# EAGLE design Pi_Cap (EAGLE 6.5.0)
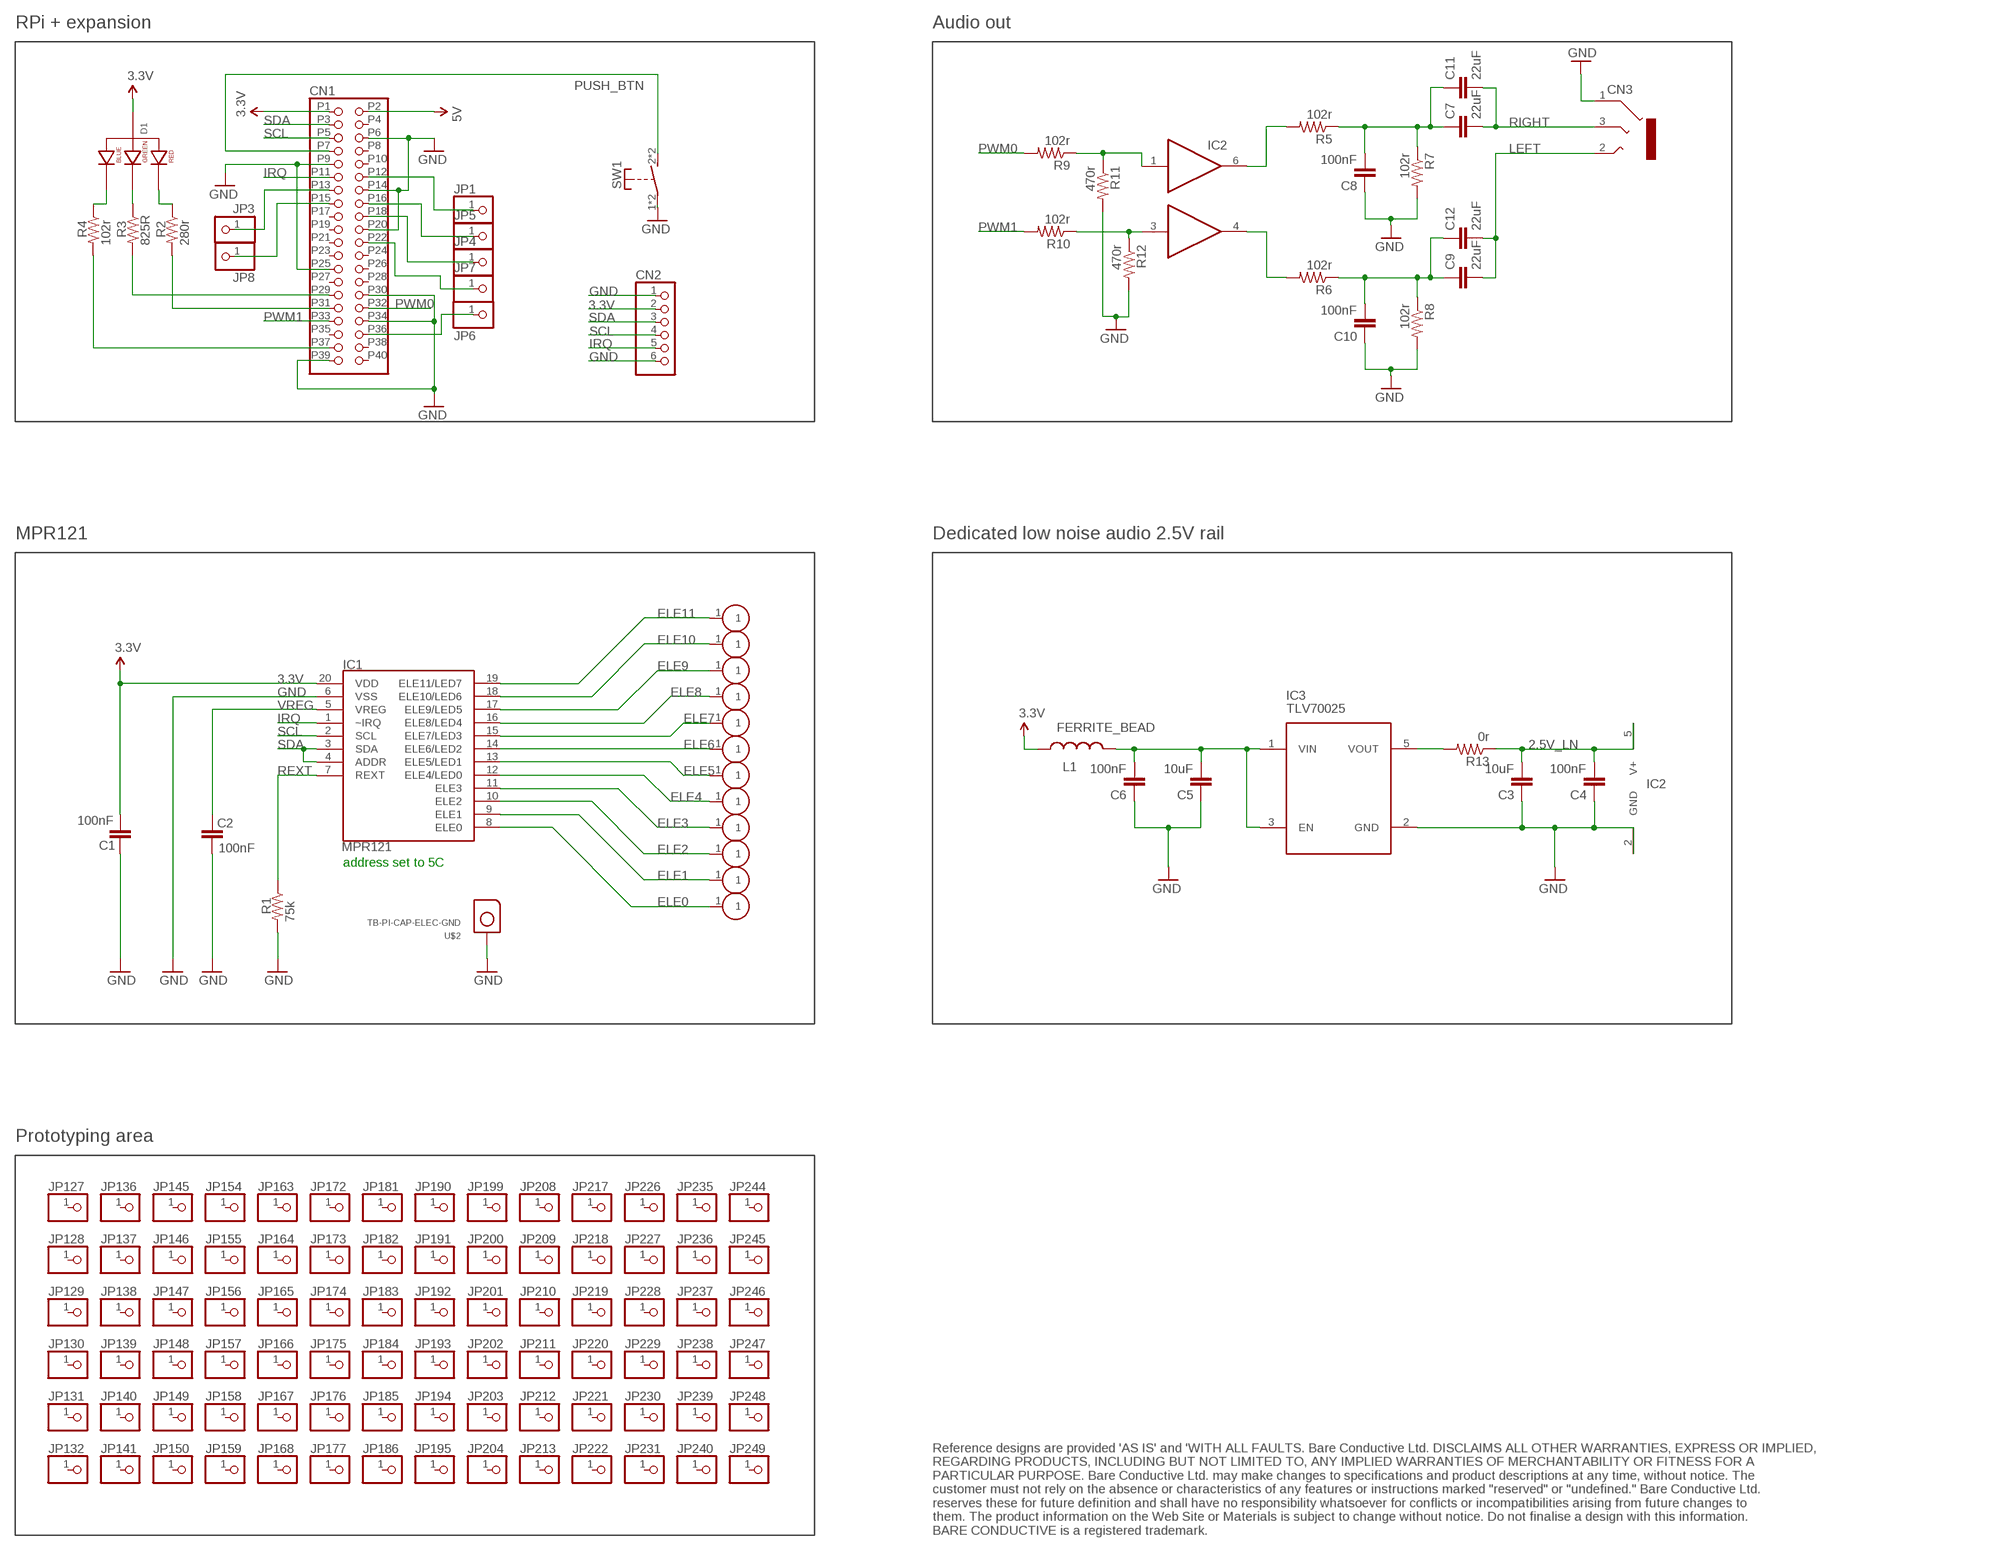
[diagram p0: schematic, sheet 1]

## Parts
C1  100nF  CAP0402-CAP  [0402-CAP]
C2  100nF  CAP0402-CAP  [0402-CAP]
C3  10uF  CAP1206  [1206]
C4  100nF  CAP0402-CAP  [0402-CAP]
C5  10uF  CAP1206  [1206]
C6  100nF  CAP0402-CAP  [0402-CAP]
C7  22uF  CAP1206  [1206]
C8  100nF  CAP0402-CAP  [0402-CAP]
C9  22uF  CAP1206  [1206]
C10  100nF  CAP0402-CAP  [0402-CAP]
C11  22uF  CAP1206  [1206]
C12  22uF  CAP1206  [1206]
CN1  PINHD-2X20/2X20_SMD  [2X20_SMD]
CN2  6W_0.5MM_FFC_RA_SMD  6W_0.5MM_FFC_RA  [6W_0.5MM_FFC_RA_SMD]
CN3  STEREO_SOCKET  SMD_STEREO_SOCKET  [SMD_STEREO_SOCKET]
D1  PLCC4_RGB_LED  LED_RGB_CA  [LED-3528]
IC1  MPR121  MPR121QFN20  [QFN-20-0.4MM]
IC2  DUAL_BUFFER  74LVC2G34GW  [SOT-363]
IC3  TLV70025  TLV00XX  [SC70]
JP1  PINHD-1X1CB  [1X01-CLEANBIG]
JP3  PINHD-1X1CB  [1X01-CLEANBIG]
JP4  PINHD-1X1CB  [1X01-CLEANBIG]
JP5  PINHD-1X1CB  [1X01-CLEANBIG]
JP6  PINHD-1X1CB  [1X01-CLEANBIG]
JP7  PINHD-1X1CB  [1X01-CLEANBIG]
JP8  PINHD-1X1CB  [1X01-CLEANBIG]
JP127  PINHD-1X1CB  [1X01-CLEANBIG]
JP128  PINHD-1X1CB  [1X01-CLEANBIG]
JP129  PINHD-1X1CB  [1X01-CLEANBIG]
JP130  PINHD-1X1CB  [1X01-CLEANBIG]
JP131  PINHD-1X1CB  [1X01-CLEANBIG]
JP132  PINHD-1X1CB  [1X01-CLEANBIG]
JP136  PINHD-1X1CB  [1X01-CLEANBIG]
JP137  PINHD-1X1CB  [1X01-CLEANBIG]
JP138  PINHD-1X1CB  [1X01-CLEANBIG]
JP139  PINHD-1X1CB  [1X01-CLEANBIG]
JP140  PINHD-1X1CB  [1X01-CLEANBIG]
JP141  PINHD-1X1CB  [1X01-CLEANBIG]
JP145  PINHD-1X1CB  [1X01-CLEANBIG]
JP146  PINHD-1X1CB  [1X01-CLEANBIG]
JP147  PINHD-1X1CB  [1X01-CLEANBIG]
JP148  PINHD-1X1CB  [1X01-CLEANBIG]
JP149  PINHD-1X1CB  [1X01-CLEANBIG]
JP150  PINHD-1X1CB  [1X01-CLEANBIG]
JP154  PINHD-1X1CB  [1X01-CLEANBIG]
JP155  PINHD-1X1CB  [1X01-CLEANBIG]
JP156  PINHD-1X1CB  [1X01-CLEANBIG]
JP157  PINHD-1X1CB  [1X01-CLEANBIG]
JP158  PINHD-1X1CB  [1X01-CLEANBIG]
JP159  PINHD-1X1CB  [1X01-CLEANBIG]
JP163  PINHD-1X1CB  [1X01-CLEANBIG]
JP164  PINHD-1X1CB  [1X01-CLEANBIG]
JP165  PINHD-1X1CB  [1X01-CLEANBIG]
JP166  PINHD-1X1CB  [1X01-CLEANBIG]
JP167  PINHD-1X1CB  [1X01-CLEANBIG]
JP168  PINHD-1X1CB  [1X01-CLEANBIG]
JP172  PINHD-1X1CB  [1X01-CLEANBIG]
JP173  PINHD-1X1CB  [1X01-CLEANBIG]
JP174  PINHD-1X1CB  [1X01-CLEANBIG]
JP175  PINHD-1X1CB  [1X01-CLEANBIG]
JP176  PINHD-1X1CB  [1X01-CLEANBIG]
JP177  PINHD-1X1CB  [1X01-CLEANBIG]
JP181  PINHD-1X1CB  [1X01-CLEANBIG]
JP182  PINHD-1X1CB  [1X01-CLEANBIG]
JP183  PINHD-1X1CB  [1X01-CLEANBIG]
JP184  PINHD-1X1CB  [1X01-CLEANBIG]
JP185  PINHD-1X1CB  [1X01-CLEANBIG]
JP186  PINHD-1X1CB  [1X01-CLEANBIG]
JP190  PINHD-1X1CB  [1X01-CLEANBIG]
JP191  PINHD-1X1CB  [1X01-CLEANBIG]
JP192  PINHD-1X1CB  [1X01-CLEANBIG]
JP193  PINHD-1X1CB  [1X01-CLEANBIG]
JP194  PINHD-1X1CB  [1X01-CLEANBIG]
JP195  PINHD-1X1CB  [1X01-CLEANBIG]
JP199  PINHD-1X1CB  [1X01-CLEANBIG]
JP200  PINHD-1X1CB  [1X01-CLEANBIG]
JP201  PINHD-1X1CB  [1X01-CLEANBIG]
JP202  PINHD-1X1CB  [1X01-CLEANBIG]
JP203  PINHD-1X1CB  [1X01-CLEANBIG]
JP204  PINHD-1X1CB  [1X01-CLEANBIG]
JP208  PINHD-1X1CB  [1X01-CLEANBIG]
JP209  PINHD-1X1CB  [1X01-CLEANBIG]
JP210  PINHD-1X1CB  [1X01-CLEANBIG]
JP211  PINHD-1X1CB  [1X01-CLEANBIG]
JP212  PINHD-1X1CB  [1X01-CLEANBIG]
JP213  PINHD-1X1CB  [1X01-CLEANBIG]
JP217  PINHD-1X1CB  [1X01-CLEANBIG]
JP218  PINHD-1X1CB  [1X01-CLEANBIG]
JP219  PINHD-1X1CB  [1X01-CLEANBIG]
JP220  PINHD-1X1CB  [1X01-CLEANBIG]
JP221  PINHD-1X1CB  [1X01-CLEANBIG]
JP222  PINHD-1X1CB  [1X01-CLEANBIG]
JP226  PINHD-1X1CB  [1X01-CLEANBIG]
JP227  PINHD-1X1CB  [1X01-CLEANBIG]
JP228  PINHD-1X1CB  [1X01-CLEANBIG]
JP229  PINHD-1X1CB  [1X01-CLEANBIG]
JP230  PINHD-1X1CB  [1X01-CLEANBIG]
JP231  PINHD-1X1CB  [1X01-CLEANBIG]
JP235  PINHD-1X1CB  [1X01-CLEANBIG]
JP236  PINHD-1X1CB  [1X01-CLEANBIG]
JP237  PINHD-1X1CB  [1X01-CLEANBIG]
JP238  PINHD-1X1CB  [1X01-CLEANBIG]
JP239  PINHD-1X1CB  [1X01-CLEANBIG]
JP240  PINHD-1X1CB  [1X01-CLEANBIG]
JP244  PINHD-1X1CB  [1X01-CLEANBIG]
JP245  PINHD-1X1CB  [1X01-CLEANBIG]
JP246  PINHD-1X1CB  [1X01-CLEANBIG]
JP247  PINHD-1X1CB  [1X01-CLEANBIG]
JP248  PINHD-1X1CB  [1X01-CLEANBIG]
JP249  PINHD-1X1CB  [1X01-CLEANBIG]
L1  FERRITE_BEAD  INDUCTOR0402  [C0402]
R1  75k  RESISTOR0402-RES  [0402-RES]
R2  280r  RESISTOR0402-RES  [0402-RES]
R3  825R  RESISTOR0402-RES  [0402-RES]
R4  102r  RESISTOR0402-RES  [0402-RES]
R5  102r  RESISTOR0402-RES  [0402-RES]
R6  102r  RESISTOR0402-RES  [0402-RES]
R7  102r  RESISTOR0402-RES  [0402-RES]
R8  102r  RESISTOR0402-RES  [0402-RES]
R9  102r  RESISTOR0402-RES  [0402-RES]
R10  102r  RESISTOR0402-RES  [0402-RES]
R11  470r  RESISTOR0402-RES  [0402-RES]
R12  470r  RESISTOR0402-RES  [0402-RES]
R13  0r  RESISTOR0402-RES  [0402-RES]
SW1  SMD_RA_PUSH_SW  [SMD_RA_PUSH_SW]
U$1  EDGE-ELEC-LEFT  [EDGE-ELEC-LEFT]
U$2  TB-PI-CAP-ELEC-GND  [TB-PI-CAP-ELEC-GND]
U$3  EDGE-ELEC-RIGHT  [EDGE-ELEC-RIGHT]
U$17  EDGE-ELEC  [EDGE-ELEC]
U$18  EDGE-ELEC  [EDGE-ELEC]
U$22  EDGE-ELEC  [EDGE-ELEC]
U$24  EDGE-ELEC  [EDGE-ELEC]
U$26  EDGE-ELEC  [EDGE-ELEC]
U$27  EDGE-ELEC  [EDGE-ELEC]
U$28  EDGE-ELEC  [EDGE-ELEC]
U$29  EDGE-ELEC  [EDGE-ELEC]
U$30  EDGE-ELEC  [EDGE-ELEC]
U$31  EDGE-ELEC  [EDGE-ELEC]

## Nets
2.5V_LN: C3.2 C4.2 IC2.5(V+) R13.1
3.3V: C1.1 CN1.P1 CN2.2 D1.1(ANODE) IC1.20(VDD) L1.1
5V: CN1.P2
ELE0: IC1.8(ELE0) U$1.1
ELE1: IC1.9(ELE1) U$31.1
ELE2: IC1.10(ELE2) U$30.1
ELE3: IC1.11(ELE3) U$29.1
ELE4: IC1.12(ELE4/LED0) U$28.1
ELE5: IC1.13(ELE5/LED1) U$27.1
ELE6: IC1.14(ELE6/LED2) U$26.1
ELE7: IC1.15(ELE7/LED3) U$24.1
ELE8: IC1.16(ELE8/LED4) U$22.1
ELE9: IC1.17(ELE9/LED5) U$18.1
ELE10: IC1.18(ELE10/LED6) U$17.1
ELE11: IC1.19(ELE11/LED7) U$3.1
GND: C1.2 C2.1 C3.1 C4.1 C5.1 C6.1 C8.1 C10.1 CN1.P6 CN1.P9 CN1.P14 CN1.P20 CN1.P25 CN1.P30 CN1.P34 CN1.P39 CN2.1 CN2.6 CN3.1 IC1.6(VSS) IC2.2(GND) IC3.2(GND) R1.2 R7.2 R8.2 R11.2 R12.2 SW1.1(P) SW1.3(P) U$2.1
IRQ: CN1.P11 CN2.5 IC1.1(~IRQ)
LEFT: C9.2 C12.2 CN3.2
N$1: D1.2(BLUE_CATHODE) R4.1
N$2: D1.4(GREEN_CATHODE) R3.1
N$3: D1.3(RED_CATHODE) R2.1
N$4: CN1.P31 R2.2
N$5: CN1.P29 R3.2
N$6: CN1.P13 JP3.1
N$8: CN1.P37 R4.2
N$9: CN1.P36 JP6.1
N$10: CN1.P22 JP7.1
N$11: CN1.P18 JP4.1
N$12: CN1.P16 JP5.1
N$13: IC2.1(IN_1) R9.1 R11.1
N$14: CN1.P12 JP1.1
N$15: IC2.6(OUT_1) R5.2
N$16: IC2.4(OUT_2) R6.2
N$17: CN1.P15 JP8.1
N$18: C7.1 C8.2 C11.1 R5.1 R7.1
N$19: IC2.3(IN_2) R10.1 R12.1
N$20: C9.1 C10.2 C12.1 R6.1 R8.1
N$21: C5.2 C6.2 IC3.1(VIN) IC3.3(EN) L1.2
N$22: IC3.5(VOUT) R13.2
PUSH_BTN: CN1.P7 SW1.2(S) SW1.4(S)
PWM0: CN1.P32 R9.2
PWM1: CN1.P33 R10.2
REXT: IC1.7(REXT) R1.1
RIGHT: C7.2 C11.2 CN3.3
SCL: CN1.P5 CN2.4 IC1.2(SCL)
SDA: CN1.P3 CN2.3 IC1.3(SDA) IC1.4(ADDR)
VREG: C2.2 IC1.5(VREG)
Unconnected: CN1.P4 CN1.P8 CN1.P10 CN1.P17 CN1.P19 CN1.P21 CN1.P23 CN1.P24 CN1.P26 CN1.P27 CN1.P28 CN1.P35 CN1.P38 CN1.P40 JP127.1 JP128.1 JP129.1 JP130.1 JP131.1 JP132.1 JP136.1 JP137.1 JP138.1 JP139.1 JP140.1 JP141.1 JP145.1 JP146.1 JP147.1 JP148.1 JP149.1 JP150.1 JP154.1 JP155.1 JP156.1 JP157.1 JP158.1 JP159.1 JP163.1 JP164.1 JP165.1 JP166.1 JP167.1 JP168.1 JP172.1 JP173.1 JP174.1 JP175.1 JP176.1 JP177.1 JP181.1 JP182.1 JP183.1 JP184.1 JP185.1 JP186.1 JP190.1 JP191.1 JP192.1 JP193.1 JP194.1 JP195.1 JP199.1 JP200.1 JP201.1 JP202.1 JP203.1 JP204.1 JP208.1 JP209.1 JP210.1 JP211.1 JP212.1 JP213.1 JP217.1 JP218.1 JP219.1 JP220.1 JP221.1 JP222.1 JP226.1 JP227.1 JP228.1 JP229.1 JP230.1 JP231.1 JP235.1 JP236.1 JP237.1 JP238.1 JP239.1 JP240.1 JP244.1 JP245.1 JP246.1 JP247.1 JP248.1 JP249.1

## Notes on the sheet
- RPi + expansion | Audio out
- MPR121 | Dedicated low noise audio 2.5V rail
- IC2
- address set to 5C
- Prototyping area
- Reference designs are provided 'AS IS' and 'WITH ALL FAULTS. Bare Conductive Ltd. DISCLAIMS ALL OTHER WARRANTIES, EXPRESS OR IMPLIED,
  REGARDING PRODUCTS, INCLUDING BUT NOT LIMITED TO, ANY IMPLIED WARRANTIES OF MERCHANTABILITY OR FITNESS FOR A 
  PARTICULAR PURPOSE. Bare Conductive Ltd. may make changes to specifications and product descriptions at any time, without notice. The 
  customer must not rely on the absence or characteristics of any features or instructions marked "reserved" or "undefined." Bare Conductive Ltd.
  reserves these for future definition and shall have no responsibility whatsoever for conflicts or incompatibilities arising from future changes to 
  them. The product information on the Web Site or Materials is subject to change without notice. Do not finalise a design with this information.
  BARE CONDUCTIVE is a registered trademark.

## Library data of the parts
C1 C2 C4 C6 = SparkFun:CAP: Capacitor Standard 0603 ceramic capacitor, and 0.1" leaded capacitor.
C3 C5 C7-C12 = SparkFun-Passives:CAP: Capacitor Standard 0603 ceramic capacitor, and 0.1" leaded capacitor.
CN1 = BC-Connectors:PINHD-2X20: PIN HEADER
CN2 = BC-Connectors:6W_0.5MM_FFC_RA
CN3 = BC-Connectors:SMD_STEREO_SOCKET
D1 = BC-LED:LED_RGB_CA
IC1 = SparkFun:MPR121: MPR121 Capacitive Touch Sensor Controller
IC2 = BC-DigitalIC:74LVC2G34G
IC3 = BC-AnalogIC:TLV00XX
JP1 JP3-JP8 JP127-JP132 JP136-JP141 JP145-JP150 JP154-JP159 JP163-JP168 JP172-JP177 JP181-JP186 JP190-JP195 JP199-JP204 JP208-JP213 JP217-JP222 JP226-JP231 JP235-JP240 JP244-JP249 = adafruit:PINHD-1X1: Pin header 1x1 for 0.1" spacing With round pins
L1 = SparkFun-Passives:INDUCTOR: Inductors Basic Inductor/Choke - 0603 and 1206. Footprints are not proven and vary greatly between part numbers. SRN6045- 33uH, 20% 1.4A SDR0403-560KL - 56uH, 10%, 500mA RMS/740mA peak
R1-R4 = SparkFun:RESISTOR: Resistor Basic schematic elements and footprints for 0603, 1206, and PTH resistors.
R5-R13 = SparkFun-Passives:RESISTOR: Resistor Basic schematic elements and footprints for 0603, 1206, and PTH resistors.
SW1 = BC-Electromechanical:SMD_RA_PUSH_SW
U$1 = BareConductiveLbr:EDGE-ELEC-LEFT
U$2 = BC-Connectors:TB-PI-CAP-ELEC-GND
U$3 = BareConductiveLbr:EDGE-ELEC-RIGHT
U$17 U$18 U$22 U$24 U$26-U$31 = BareConductiveLbr:EDGE-ELEC

## Net classes
1 power: width 0.254 mm, drill 0.61 mm, clearance 0.254 mm
2 gnd: width 0.254 mm, drill 0.61 mm, clearance 0.254 mm
3 usbvcc: width 0.254 mm, drill 0.61 mm, clearance 0.254 mm
4 aref: width 0.254 mm, drill 0.61 mm, clearance 0.254 mm

## Board
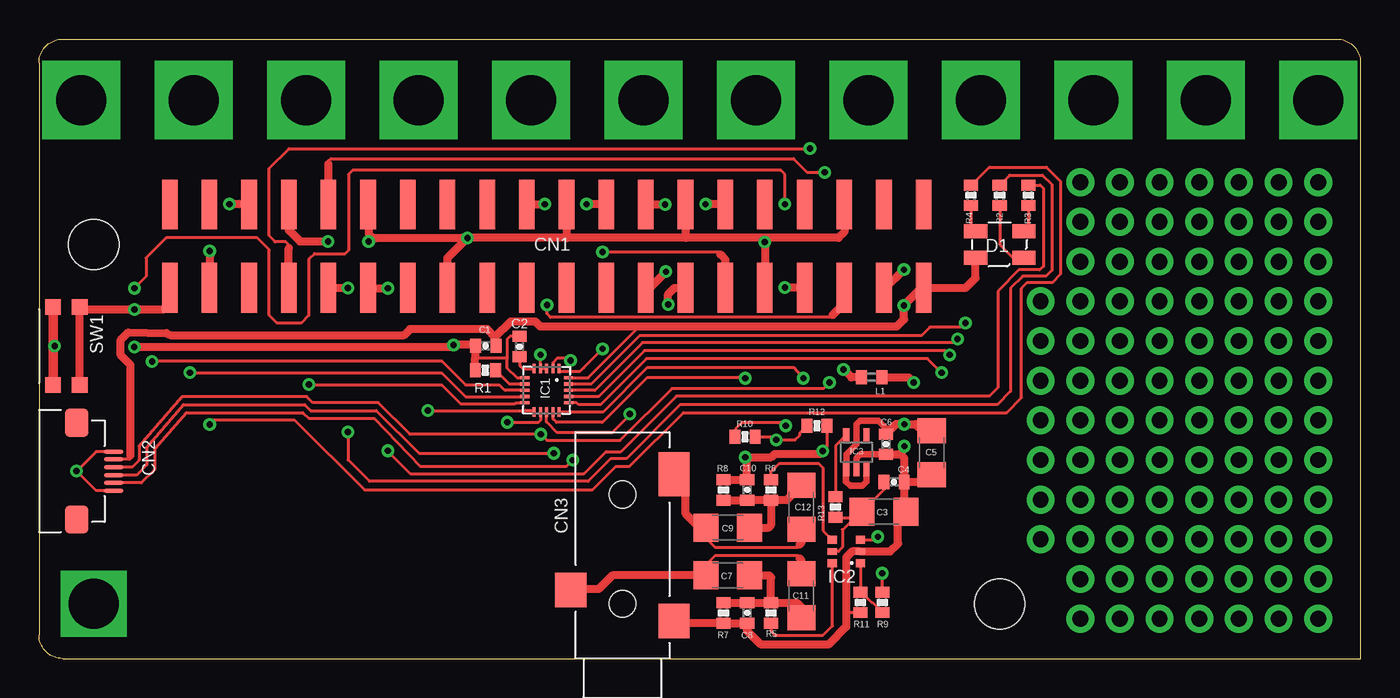
[diagram p1: board, top side]
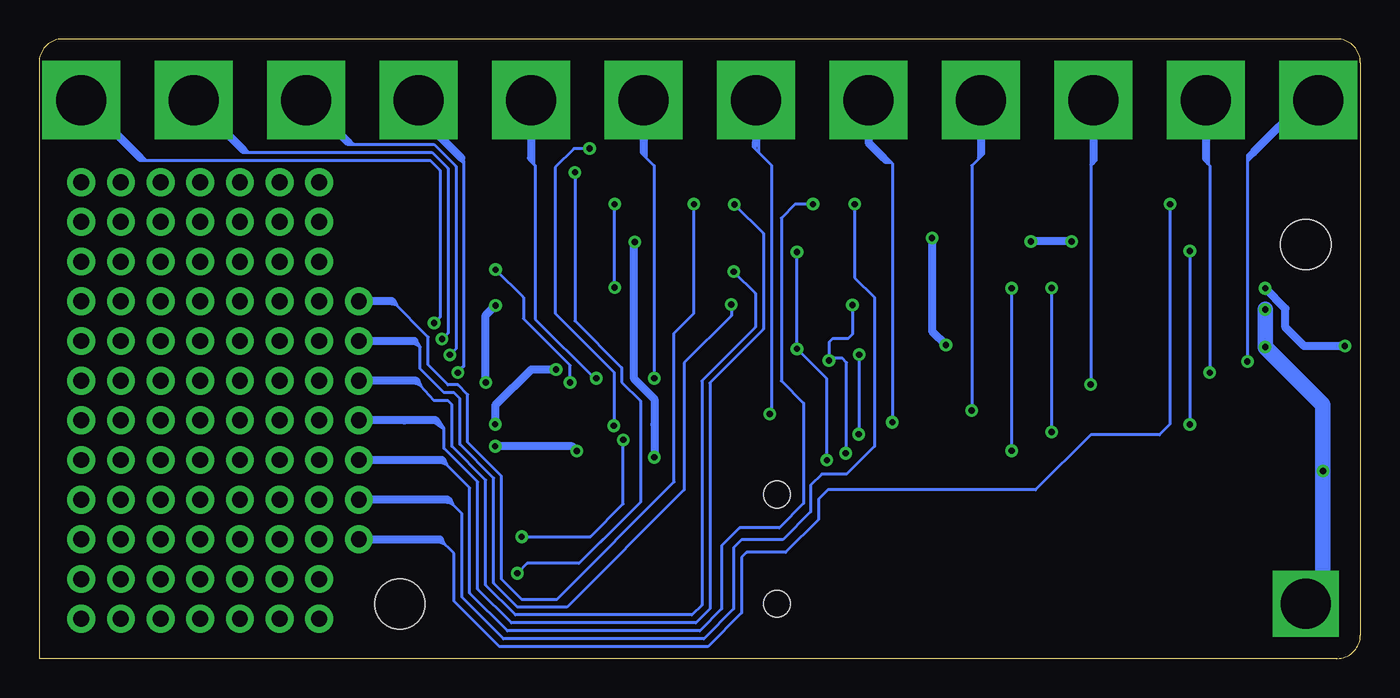
[diagram p2: board, bottom side, seen from below]

Size 84.6 x 39.65 mm. Coordinates in mm from the lower left corner, seen from the top.
Outline: 0,1.5 0,38.15 arc-90 1.5,39.65 83.1,39.65 arc-90 84.6,38.15 84.6,0 1.5,0
Outline: 1.5,0 arc-90 0,1.5
Copper layers (1*2+15*16): Top 0.035mm / dielectric 1.5mm / Route2 0.035mm / dielectric 0.15mm / Route15 0.035mm / dielectric 0.2mm / Bottom 0.035mm
Design rules "default *": minimum track width 6mil, minimum drill 0.4mm, track to track 6mil, track to pad 6mil, pad to pad 6mil, via to via 6mil, smd to smd 6mil, copper to edge 20mil, drill to drill 8mil, minimum pad ring 10mil, minimum via ring 8mil, stop-mask expansion 4mil, vias tented up to drill 0.4mm, thermal gap 10mil
Holes 3.2 mm at 3.5,26.5 61.5,3.5
tKeepout: area 0.5,23.5 to 6.5,29.5; area 0.5,0.5 to 6.5,6.5; area 58.5,0.5 to 64.5,6.5

### Footprints (pad centres in the part's own frame; a part is rotated, then mirrored left to right if it is on the bottom)
0402-CAP = smd 0.7 x 0.9: 1 -0.65,0; 2 0.65,0
1206 = smd 1.6 x 1.8: 1 -1.4,0; 2 1.4,0
2X20_SMD = smd 1 x 3.17: P1 24.13,-2.665; P2 24.13,2.665; P3 21.59,-2.665; P4 21.59,2.665; P5 19.05,-2.665; P6 19.05,2.665; P7 16.51,-2.665; P8 16.51,2.665; P9 13.97,-2.665; P10 13.97,2.665; P11 11.43,-2.665; P12 11.43,2.665; P13 8.89,-2.665; P14 8.89,2.665; P15 6.35,-2.665; P16 6.35,2.665; P17 3.81,-2.665; P18 3.81,2.665; P19 1.27,-2.665; P20 1.27,2.665; P21 -1.27,-2.665; P22 -1.27,2.665; P23 -3.81,-2.665; P24 -3.81,2.665; P25 -6.35,-2.665; P26 -6.35,2.665; P27 -8.89,-2.665; P28 -8.89,2.665; P29 -11.43,-2.665; P30 -11.43,2.665; P31 -13.97,-2.665; P32 -13.97,2.665; P33 -16.51,-2.665; P34 -16.51,2.665; P35 -19.05,-2.665; P36 -19.05,2.665; P37 -21.59,-2.665; P38 -21.59,2.665; P39 -24.13,-2.665; P40 -24.13,2.665
6W_0.5MM_FFC_RA_SMD = smd 0.3 x 1.25: 1 -1.25,4.775; 2 -0.75,4.775; 3 -0.25,4.775; 4 0.25,4.775; 5 0.75,4.775; 6 1.25,4.775 | smd 1.8 x 1.5: M1 -3.1,2.4; M2 3.1,2.4
SMD_STEREO_SOCKET = smd 2.2 x 2: 1 2.4,-3.3; 3 4.4,3.3 | smd 2.8 x 2: 2 11.8,-3.3 | hole 1.7: 3.5,0; 10.5,0
LED-3528 = smd 1.5 x 0.9: 1 1.55,0.85; 2 1.55,-0.85; 3 -1.55,0.85; 4 -1.55,-0.85
QFN-20-0.4MM = smd 0.6 x 0.2: 1 -1.4,0.8; 2 -1.4,0.4; 3 -1.4,0; 4 -1.4,-0.4; 5 -1.4,-0.8; 11 1.4,-0.8; 12 1.4,-0.4; 13 1.4,0; 14 1.4,0.4; 15 1.4,0.8 | smd 0.2 x 0.6: 6 -0.8,-1.4; 7 -0.4,-1.4; 8 0,-1.4; 9 0.4,-1.4; 10 0.8,-1.4; 16 0.8,1.4; 17 0.4,1.4; 18 0,1.4; 19 -0.4,1.4; 20 -0.8,1.4
SOT-363 = smd 0.6 x 0.5: 1 -0.9,0.75; 3 -0.9,-0.75; 4 0.9,-0.75; 6 0.9,0.75 | smd 0.6 x 0.4: 2 -0.9,0; 5 0.9,0
SC70 = smd 0.4 x 0.9: 1 -0.65,-1.1; 2 0,-1.1; 3 0.65,-1.1; 4 0.65,1.1; 5 -0.65,1.1
1X01-CLEANBIG = drill 1.016 pad 1.778: 1 0,0
C0402 = smd 0.7 x 0.9: 1 -0.65,0; 2 0.65,0
0402-RES = smd 0.7 x 0.9: 1 -0.65,0; 2 0.65,0
SMD_RA_PUSH_SW = smd 1 x 1: 1 2.5,0.85; 2 2.5,-0.85; 3 -2.5,0.85; 4 -2.5,-0.85
EDGE-ELEC-LEFT = drill 3.2 pad 5 square: 1 0,0
TB-PI-CAP-ELEC-GND = drill 3.2 pad 3.4 square: 1 0,0
EDGE-ELEC-RIGHT = drill 3.2 pad 5 square: 1 0,0
EDGE-ELEC = drill 3.2 pad 5 square: 1 0,0

### Placement (x,y rotation side)
C1  28.6,20.04 180 top
C2  30.77,19.97 270 top
C3  54.09,9.4 180 top
C4  54.74,11.3 180 top
C5  57.15,13.17 90 top
C6  54.23,13.72 90 top
C7  44.09,5.33 180 top
C8  45.34,2.92 90 top
C9  44.09,8.38 180 top
C10  45.34,10.79 270 top
C11  48.8,4.03 90 top
C12  48.8,9.69 270 top
CN1  32.5,26.4 0 top
CN2  0,12 270 top
CN3  37.35,0 90 top
D1  61.5,26.5 180 top
IC1  32.5,17.17 270 top
IC2  51.69,6.86 180 top
IC3  52.32,13.21 0 top
JP1  64.12,22.87 0 top
JP3  64.12,20.33 0 top
JP4  64.12,12.71 0 top
JP5  64.12,15.25 0 top
JP6  64.12,7.63 0 top
JP7  64.12,10.17 0 top
JP8  64.12,17.79 0 top
JP127  66.66,30.49 0 top
JP128  69.2,30.49 0 top
JP129  71.74,30.49 0 top
JP130  74.28,30.49 0 top
JP131  76.82,30.49 0 top
JP132  79.36,30.49 0 top
JP136  71.74,27.95 0 top
JP137  74.28,27.95 0 top
JP138  76.82,27.95 0 top
JP139  79.36,27.95 0 top
JP140  81.9,27.95 0 top
JP141  66.66,25.41 0 top
JP145  81.9,25.41 0 top
JP146  66.66,22.87 0 top
JP147  69.2,22.87 0 top
JP148  71.74,22.87 0 top
JP149  74.28,22.87 0 top
JP150  76.82,22.87 0 top
JP154  79.36,25.41 0 top
JP155  81.9,20.33 0 top
JP156  79.36,20.33 0 top
JP157  66.66,17.79 0 top
JP158  69.2,17.79 0 top
JP159  71.74,17.79 0 top
JP163  69.2,20.33 0 top
JP164  71.74,20.33 0 top
JP165  74.28,20.33 0 top
JP166  76.82,20.33 0 top
JP167  79.36,17.79 0 top
JP168  81.9,17.79 0 top
JP172  71.74,15.25 0 top
JP173  76.82,15.25 0 top
JP174  79.36,15.25 0 top
JP175  81.9,15.25 0 top
JP176  81.9,12.71 0 top
JP177  66.66,12.71 0 top
JP181  76.82,12.71 0 top
JP182  79.36,12.71 0 top
JP183  66.66,10.17 0 top
JP184  69.2,10.17 0 top
JP185  71.74,10.17 0 top
JP186  81.9,10.17 0 top
JP190  66.66,7.63 0 top
JP191  69.2,7.63 0 top
JP192  71.74,7.63 0 top
JP193  74.28,7.63 0 top
JP194  76.82,7.63 0 top
JP195  79.36,7.63 0 top
JP199  71.74,5.09 0 top
JP200  74.28,5.09 0 top
JP201  76.82,5.09 0 top
JP202  79.36,5.09 0 top
JP203  81.9,5.09 0 top
JP204  66.66,2.55 0 top
JP208  76.82,2.55 0 top
JP209  79.36,2.55 0 bottom
JP210  81.9,2.55 0 top
JP211  69.2,2.55 0 top
JP212  66.66,27.95 0 top
JP213  69.2,27.95 0 top
JP217  74.28,25.41 0 top
JP218  71.74,12.71 0 top
JP219  74.28,12.71 0 top
JP220  76.82,10.17 0 top
JP221  74.28,15.25 0 top
JP222  69.2,15.25 0 top
JP226  76.82,25.41 0 top
JP227  81.9,22.87 0 top
JP228  79.36,10.17 0 top
JP229  66.66,5.09 0 top
JP230  69.2,5.09 0 top
JP231  71.74,2.55 0 top
JP235  74.28,2.55 0 top
JP236  66.66,15.25 0 top
JP237  76.82,17.79 0 top
JP238  81.9,30.49 0 top
JP239  69.2,25.41 0 top
JP240  71.74,25.41 0 top
JP244  74.28,17.79 0 top
JP245  69.2,12.71 0 top
JP246  81.9,7.63 0 top
JP247  74.28,10.17 0 top
JP248  66.66,20.33 0 top
JP249  79.36,22.87 0 top
L1  53.3,18 180 top
R1  28.58,18.46 180 top
R2  61.5,29.65 90 top
R3  63.35,29.65 90 top
R4  59.65,29.65 90 top
R5  46.86,2.92 270 top
R6  46.86,10.79 90 top
R7  43.81,2.92 270 top
R8  43.81,10.79 90 top
R9  54,3.6 90 top
R10  45.2,14.2 180 top
R11  52.6,3.6 270 top
R12  49.8,14.9 0 top
R13  51,9.7 90 top
SW1  1.75,20 270 top
U$1  2.7,35.75 0 top
U$2  3.5,3.5 0 top
U$3  81.9,35.75 0 top
U$17  74.7,35.75 0 top
U$18  67.5,35.75 0 top
U$22  60.3,35.75 0 top
U$24  53.1,35.75 0 top
U$26  45.9,35.75 0 top
U$27  38.7,35.75 0 top
U$28  31.5,35.75 0 top
U$29  24.3,35.75 0 top
U$30  17.1,35.75 0 top
U$31  9.9,35.75 0 top

### Tracks (layer width: path | path; a pad name or v marks a point on that pad's centre or on a via)
2.5V_LN
  Top 0.2: C4.2 54.09,10.79 C3.2 52.29,9.09 | 52.29,9.09 52.19,9.01 51.04,9.01 51.04,9.05 R13.1 | IC2.5 51.18,6.86 51.44,7.11 51.44,8.25 51.46,8.25 52.29,9.09
3.3V  (via drill 0.4)
  Top 0.2: 29.21,20.07 C1.1 | 56.65,23.75 CN1.P1 | 5.85,13 5.9,12.85 5.8,12.75 CN2.2 | 38.21,21.26 38.45,21.26 35.16,17.97 IC1.20
  Top 0.3: 34.25,21.26 34.26,21.24 34.27,21.26
  Top 0.4: 29.21,20.58 29.21,20.57
  Top 0.5: CN1.P1 56.5,23.73 v55.37,22.61 55.37,21.72 54.92,21.26 38.45,21.26 34.27,21.26 | 29.21,20.58 30.21,21.59 31.76,21.59 32.09,21.26 34.25,21.26 | 29.21,20.07 29.21,20.57 28.7,21.08 23.75,21.08 23.37,20.7 8.38,20.7 8.15,20.84 5.72,20.89 5.2,20.37 5.2,19.45 5.85,18.8 5.85,13 | L1.1 55.66,18 v56,17.66 | 56.65,23.75 59.35,23.75 59.95,24.35 D1.1
  Bottom 0.5: v56,17.66 56,21.98 v55.37,22.61
ELE0  (via drill 0.4)
  Top 0.2: v7.24,19.01 7.5,19.01 7.5,19.05 25.78,19.05 27.3,17.53 29.46,17.53 29.82,17.17 29.86,17.17 IC1.8
  Bottom 0.2: v7.24,19.01 7.24,32.22 7.06,32.4 6.85,32.4
  Bottom 0.5: U$1.1 3.5,35.75 6.85,32.4
ELE1  (via drill 0.4)
  Top 0.2: v9.65,18.3 25.78,18.29 27.3,16.77 IC1.9
  Bottom 0.2: v9.65,18.3 9.65,31.55 10.05,31.97 10.05,32.3 9.9,32.26
  Bottom 0.5: U$31.1 9.9,32.26
ELE2  (via drill 0.4)
  Top 0.2: v17.27,17.54 25.78,17.53 26.94,16.37 26.94,16.36 27,16.3 30.45,16.3 30.52,16.37 IC1.10
  Bottom 0.2: v17.27,17.54 v17.26,17.54 17.25,17.55 17.25,31.55 17.1,31.7 16.95,31.85 16.95,32.2 17.1,32.19
  Bottom 0.5: U$30.1 17.1,32.19
ELE3  (via drill 0.4)
  Top 0.2: v24.89,15.88 25.02,15.88 25.05,15.85 31.1,15.85 31.14,15.88 31.61,15.88 31.7,15.87 IC1.11
  Bottom 0.2: v24.89,15.88 24.89,31.55 24.15,32.29 24.15,32.6 24.3,32.6 24.3,32.61
  Bottom 0.5: U$29.1 24.3,32.61
ELE4  (via drill 0.4)
  Top 0.2: v29.97,15.12 31.98,15.12 32.1,15.25 IC1.12
  Bottom 0.2: v29.97,15.12 29.97,31.7 30.52,32.25 30.52,32.05
  Bottom 0.5: U$28.1 31.5,33.02 30.52,32.05
ELE5  (via drill 0.4)
  Top 0.2: v37.83,15.65 37.86,15.63 36.7,14.48 33.15,14.48 32.51,15.11 32.5,15.11 IC1.13
  Bottom 0.2: v37.83,15.65 37.69,15.78 37.69,31.55 38.77,32.63 38.85,32.72 | 38.7,33.12 38.77,33.05 38.85,32.72 | 38.85,32.72 38.85,33.07
  Bottom 0.5: U$27.1 38.7,33.12
ELE6  (via drill 0.4)
  Top 0.2: IC1.14 32.9,15.33 33.12,15.11 36.07,15.11 38.92,17.96 45.08,17.96 v45.21,17.94
  Bottom 0.2: v45.21,17.94 45.21,31.55 46.05,32.39 46.05,32.7 45.9,32.7
  Bottom 0.5: U$26.1 45.9,32.7
ELE7  (via drill 0.4)
  Top 0.2: IC1.15 36.09,15.77 38.97,18.65 48.33,18.65 v48.93,17.94
  Bottom 0.2: v48.93,17.94 49.04,17.94 52.83,21.73 52.83,31.55 53.19,31.91 | 53.25,31.97 53.19,31.91 | 53.1,32.03 53.19,31.94 53.19,31.91
  Bottom 0.5: U$24.1 53.1,32.03
ELE8  (via drill 0.4)
  Top 0.2: IC1.16 34.43,16.37 34.54,16.26 35.94,16.26 38.89,19.2 56.88,19.2 v57.78,18.3
  Bottom 0.2: 57.57,32.05 58.39,32.67 58.4,32.67 57.4,31.69 57.4,18.71 v57.78,18.3
  Bottom 0.5: 57.57,32.05 60.33,34.81 60.33,35.77 U$22.1
ELE9  (via drill 0.4)
  Top 0.2: IC1.17 35.82,16.77 38.76,19.71 58.02,19.71 v58.29,19.44
  Bottom 0.2: v58.29,19.44 57.91,19.82 57.91,31.51 59.31,32.9 64.79,32.9 64.79,33.05 64.8,33.06
  Bottom 0.5: U$18.1 64.8,33.06
ELE10  (via drill 0.4)
  Top 0.2: v58.8,20.46 58.56,20.22 38.63,20.22 35.59,17.17 IC1.18
  Bottom 0.2: 71.85,32.7 71.53,32.55 71.57,32.51 71.57,32.39 59.44,32.39 58.42,31.38 58.42,20.84 v58.8,20.46
  Bottom 0.5: U$17.1 74.7,35.72 71.53,32.55
ELE11  (via drill 0.4)
  Top 0.2: v59.31,21.47 59.05,21.21 57.02,21.21 56.49,20.68 38.46,20.68 35.35,17.57 IC1.19
  Bottom 0.2: 78.11,32.04 78.58,32.3 78.54,32.3 78.13,31.89 59.56,31.89 58.93,31.25 58.93,21.85 v59.31,21.47
  Bottom 0.5: U$3.1 81.84,35.75 78.11,32.04
GND  (via drill 0.4)
  Top 0.2: 27.93,19.26 27.93,20.02 C1.2 | C1.2 27.95,19.64 27.93,19.62 | 27.93,19.27 27.93,19.26 | 27.93,19.26 29.97,19.26 | IC1.6 30.59,17.97 29.97,18.59 29.97,19.26 | 27.91,20.08 C1.2 | C2.1 30.15,20.62 29.97,20.45 29.97,19.25 29.97,19.26 | 41.53,2.27 CN3.1 41.4,2.4 | 55.39,9.79 C3.1 54.99,9.39 | 5.99,20.05 v6.1,19.94 | 57.02,11.3 C5.1 | R12.2 50.45,13.57 v50.16,13.28 | R11.2 51.84,2.95 51.67,2.8 | 4.55,10.75 CN2.6 3.65,10.75 v2.4,12 3.65,13.25 CN2.1 | SW1.1 2.54,17.56 2.54,22.35
  Top 0.4: C6.1 52.58,13.07 52.32,12.81 IC3.2
  Top 0.5: R1.2 27.93,19.26 | 27.93,19.62 27.93,19.27 | R8.2 C10.1 45.34,12.76 v45.21,12.89 46.89,12.89 47.1,13.1 49.98,13.1 v50.16,13.28 | 41.53,2.27 R7.2 C8.1 45.34,1.78 46.22,0.9 50.54,0.9 51.67,2.03 51.67,2.8 51.67,6.46 52.07,6.86 IC2.2 54.48,6.86 54.99,7.37 54.99,9.39 | C4.1 55.39,9.79 | C4.1 57.02,11.3 | 27.91,20.08 26.56,20.08 | 26.56,20.08 v26.54,20.08 | 26.56,20.08 26.42,19.94 v6.1,19.94 | C6.1 55.13,13.07 | 55.13,13.07 55.37,12.83 55.37,11.32 C4.1 | v55.4,13.59 55.4,13.43 55.13,13.07 | CN1.P6 51.55,27.29 51.18,26.92 46.61,26.92 | 46.61,26.92 v46.46,26.67 v46.47,26.67 CN1.P9 | 46.61,26.92 41.39,26.92 | 41.39,26.92 33.8,26.92 | 33.8,26.92 v27.43,26.92 | CN1.P14 41.39,26.92 | CN1.P25 26.15,25.64 v27.43,26.92 | CN1.P20 33.77,26.95 33.8,26.92 | CN1.P30 21.1,29.03 21.1,27.2 21.38,26.92 | 21.38,26.92 v27.43,26.92 | CN1.P34 16,29.05 16,27.4 16.7,26.7 v18.5,26.7 | v21.1,26.7 21.32,26.92 21.38,26.92 | SW1.1 SW1.3 | 2.54,22.35 v6.1,22.35 7.93,22.35 8.2,22.62 8.2,23.56 CN1.P39
  Bottom 0.5: v27.43,26.92 27.43,20.96 v26.54,20.08 | v46.46,26.67 46.5,26.67 46.5,17.9 45.2,16.6 45.2,15 v45.21,12.89 | v18.5,26.7 v21.1,26.7 | v50.16,13.28 50.47,13.59 v55.4,13.59
  Bottom 1: v6.1,22.35 6.1,21.8 v6.1,19.94 2.4,16.24 v2.4,12 2.4,4.6 U$2.1
IRQ  (via drill 0.4)
  Top 0.2: v34.16,12.7 33.78,12.32 24.38,12.32 21.46,15.37 17.27,15.37 16.89,15.75 9.45,15.75 7.4,13.4 7.4,12.1 6.55,11.25 CN2.5 | v36.08,19.82 34.86,18.61 34.82,18.57 34.62,18.37 33.3,18.37 IC1.1 | v36.08,26.02 43.58,26.02 43.61,25.87
  Top 0.5: 43.61,25.87 43.93,25.55 CN1.P11
  Bottom 0.2: v36.08,26.02 v36.08,19.82 34.16,17.91 v34.16,12.7
LEFT
  Top 0.2: C9.2 42.7,7.7 43.3,7.1 48.6,7.1 48.7,7.3
  Top 0.5: C9.2 42.29,8.38 41.4,9.27 41.4,11.8 CN3.2 | C12.2 48.8,7.4 48.7,7.3
N$1
  Top 0.2: R4.1 59.65,27.65 D1.2
N$2
  Top 0.2: 62.45,27.65 62.75,27.65 D1.4 63.35,27.35 R3.1
N$3
  Top 0.2: 63.6,25.9 63.3,25.9 D1.3 63,25.6 62.4,25.6 61.5,26.5 R2.1
N$4  (via drill 0.4)
  Top 0.2: R2.2 62.15,30.95 64.25,30.95 64.85,30.35 64.85,24.85 64.47,24.47 62.98,24.47 62.2,23.7 62.2,17.1 61.35,16.25 41.05,16.25 37.6,12.8 36.6,12.8 35.15,11.35 21.15,11.35 19.77,12.72 v19.77,14.5
  Top 0.5: CN1.P31 v19.77,23.73 v19.77,23.72
  Bottom 0.2: v19.77,23.72 v19.77,14.5
N$5  (via drill 0.4)
  Top 0.2: R3.2 64.1,30.3 64.3,30.1 64.3,25.1 64.08,24.87 62.73,24.87 61.4,23.5 61.4,17.35 60.85,16.8 40.8,16.8 37.25,13.25 36.3,13.25 34.85,11.8 23.8,11.8 22.32,13.27 v22.32,13.3
  Top 0.5: CN1.P29 21.1,23.7 v22.32,23.7
  Bottom 0.2: v22.32,13.3 v22.32,23.7
N$6  (via drill 0.4)
  Top 0.5: 41.01,23.73 CN1.P13 41.38,23.72 40.67,23.72 40.28,23.33 v40.28,22.66
  Bottom 0.2: v40.28,22.66 40.28,21.95 43.31,18.92 43.31,10.79 50.8,3.3 53.98,3.3 55.5,4.83 55.5,11.56 57.66,13.72 57.66,16.64 58.04,17.02 58.67,17.02 60.2,18.54 60.2,19.94 60.58,20.32
  Bottom 0.5: 60.58,20.32 JP3.1
N$8  (via drill 0.4)
  Top 0.2: R4.2 59.7,30.3 60.85,31.45 64.5,31.45 65.4,30.55 65.4,24.6 64.9,24.07 63.27,24.07 62.9,23.7 62.9,16.7 61.95,15.75 41.25,15.75 37.8,12.3 36.94,12.3 35.43,10.79 20.83,10.79 16.37,15.25 11.19,15.25 v10.92,14.99
  Top 0.5: v10.92,26.09 v10.91,26.09 CN1.P37
  Bottom 0.2: v10.92,26.09 v10.92,14.99
N$9  (via drill 0.4)
  Top 0.5: CN1.P36 12.21,29.06 v12.19,29.08
  Bottom 0.2: v12.19,29.08 12.19,15.01 12.88,14.32 17.27,14.32 20.8,10.8 34.1,10.8 34.7,10.2 34.7,8.9 36.8,6.8 39.3,6.8 39.62,6.48 39.62,2.92 41.78,0.76 55.12,0.76 58.04,3.68 58.04,6.73 58.93,7.62
  Bottom 0.5: 58.93,7.62 JP6.1
N$10  (via drill 0.4)
  Top 0.5: CN1.P22 32.38,29.06 v32.38,29.08
  Bottom 0.2: v32.38,29.08 32.38,24.38 31.11,23.11 31.11,13.59 32.89,11.81 34.49,11.81 35.2,11.1 35.2,9.39 36.98,7.61 39.62,7.61 40.13,7.1 40.13,3.17 42.04,1.27 54.86,1.27 57.53,3.94 57.53,9.27 58.42,10.16
  Bottom 0.5: 58.42,10.16 JP7.1
N$11  (via drill 0.4)
  Top 0.5: CN1.P18 36.29,29.08 v35.05,29.08
  Bottom 0.2: v35.05,29.08 36.2,29.08 37.08,28.19 37.08,17.78 35.65,16.34 35.65,9.93 37.21,8.37 39.75,8.37 40.89,7.23 40.89,3.17 42.29,1.78 54.61,1.78 57.02,4.19 57.02,10.92 58.8,12.7
  Bottom 0.5: 58.8,12.7 JP4.1
N$12  (via drill 0.4)
  Top 0.5: CN1.P16 v40.08,29.06
  Bottom 0.2: v40.08,29.06 38.23,27.21 38.23,21.08 41.66,17.65 41.66,3.17 42.55,2.29 54.36,2.29 56.52,4.44 56.52,11.3 58.67,13.46 58.67,14.73 59.18,15.24 | 61.21,15.24 61.22,15.25
  Bottom 0.5: 59.18,15.24 61.21,15.24 | 61.22,15.25 JP5.1
N$13
  Top 0.2: R9.1 53.35,3.6 53.3,3.6 52.65,4.25 R11.1 52.59,4.26 IC2.1
N$14  (via drill 0.4)
  Top 0.5: CN1.P12 42.69,29.06 v42.67,29.08
  Bottom 0.2: 61.98,22.86 59.69,20.57 59.69,18.8 58.42,17.53 57.78,17.53 57.15,16.89 57.15,13.84 54.99,11.68 54.99,5.08 53.72,3.81 51.44,3.81 43.94,11.3 43.94,20.83 42.67,22.1 v42.67,29.08
  Bottom 0.5: 61.98,22.86 JP1.1
N$15
  Top 0.2: IC2.6 50.8,6.1 50.8,2.1 50.2,1.5 47.1,1.5 46.86,1.74 R5.2
N$16
  Top 0.2: IC2.4 50.2,8.2 50.2,12.2 49.9,12.5 47.4,12.5 46.86,11.96 R6.2
N$17  (via drill 0.4)
  Top 0.5: CN1.P15 39.1,23.73 v40.13,24.76
  Bottom 0.2: v40.13,24.76 38.73,23.37 38.73,21.21 42.16,17.78 42.16,3.43 42.8,2.79 54.1,2.79 56.01,4.7 56.01,11.43 58.17,13.59 58.17,16.26 58.42,16.51 59.31,16.51 60.45,17.78
  Bottom 0.5: 60.45,17.78 JP8.1
N$18
  Top 0.5: R7.1 C8.2 R5.1 | R5.1 46.86,5.2 46.73,5.33 C7.1 | R5.1 48.53,3.57 48.8,3.3 C11.1
N$19  (via drill 0.4)
  Top 0.2: 49.1,14.85 R12.1 48.7,14.45 48.7,14.3 48.4,14 v47.2,14 47,14.2 R10.1 | IC2.3 53.51,7.61 v53.7,7.8
  Bottom 0.2: v53.7,7.8 49.3,7.8 47.2,9.9 v47.2,14
N$20
  Top 0.2: R6.1 46.85,10.03
  Top 0.5: R8.1 C10.2 R6.1 47.85,10.14 C12.1 | 46.85,10.03 46.85,8.53 46.7,8.38 C9.1
N$21  (via drill 0.4)
  Top 0.2: 52.96,12.09 IC3.3 | C6.2 54.23,14.73 | 51.69,12.12 IC3.1
  Top 0.4: IC3.1 51.67,11.32 51.94,11.05 52.7,11.05 52.96,11.3 52.96,12.09 | 54.23,14.73 53.75,15.21 52.55,15.21 52.32,14.99 52.33,13.71 51.69,13.07 51.69,12.12
  Top 0.5: L1.2 52,18 v51.5,18.5 | C6.2 54.86,15 v55.4,15 56.12,15 56.55,14.57 C5.2
  Bottom 0.5: v51.5,18.5 53.1,18.5 55.4,16.2 v55.4,15
N$22
  Top 0.2: IC3.5 51,13.63 R13.2
N$24
  Bottom 0.2: 7.24,32.23 6.96,32.5 6.68,32.51
N$25
  Bottom 0.2: 57.4,31.69 57.41,32.08
N$26
  Bottom 0.2: 78.05,32.17 78.03,32.17 77.78,31.92
N$27
  Bottom 0.2: 6.82,32.3 6.8,32.31 6.72,32.31 7.24,31.8 7.24,31.76
N$29
  Bottom 0.2: 7.04,32.22 7.12,32.14 7.12,32.1
N$30
  Bottom 0.2: 38.75,32.67 38.55,33.1
N$31
  Bottom 0.2: 45.75,32.67 45.75,32.12
N$32
  Bottom 0.2: 45.92,32.47 45.85,32.35
N$33
  Bottom 0.2: 38.55,33.12 38.55,32.42
N$34
  Bottom 0.2: 53.25,31.97 53.25,32.1 52.95,32.1 52.95,31.67
N$35
  Bottom 0.2: 71.45,32.6 71.4,32.62 71.2,32.42
N$36
  Bottom 0.2: 64.67,33.15 64.45,32.92
N$37
  Bottom 0.2: 31.4,33.22 31.35,33.25
N$38
  Bottom 0.2: 61.83,22.9 61.7,22.6 62.05,22.7
N$39
  Bottom 0.2: 60.2,19.95 60.45,20.4
N$40
  Bottom 0.2: 60.23,19.95 60.67,20.2
N$41
  Bottom 0.2: 60.33,17.85 60.17,17.47 60.58,17.65
N$42
  Bottom 0.2: 58.67,14.72 59.08,15.35
N$43
  Bottom 0.2: 58.7,14.72 59.35,15.15
N$44
  Bottom 0.2: 58.67,12.77 58.5,12.4 58.92,12.57
N$45
  Bottom 0.2: 58.3,10.25 58.12,9.87 58.55,10.02
N$46
  Bottom 0.2: 58.8,7.7 58.62,7.32 59.15,7.5
N$48
  Bottom 0.2: 24.43,32.6 24.45,32.6 24.45,32.02 24.25,32.42
N$49
  Bottom 0.2: 30.05,31.77 30.05,31.75 30.44,31.75 30.73,32.04
N$50
  Bottom 0.2: 30.36,31.93 30.27,31.85
N$51
  Bottom 0.2: 17.23,32.17 17.25,32.17 17.25,31.57 17.07,31.95
N$52
  Bottom 0.2: 9.78,32.25 9.75,32.25 9.75,31.65 9.95,32.02
PUSH_BTN  (via drill 0.4)
  Top 0.2: v47.75,29.08 47.75,30.99 47.5,31.24 20.07,31.24 19.81,30.99 19.81,26.13 19.6,25.92 17.63,25.92 17.27,25.56 17.27,21.97 16.76,21.46 15.24,21.46 14.73,21.97 14.73,26.16 13.97,26.92 8.13,26.92 6.86,25.65 6.86,24.46 v6.1,23.7
  Top 0.5: CN1.P7 47.77,23.73 v47.75,23.75 | 0.9,22.74 SW1.4
  Top 0.61: SW1.4 0.9,20 | SW1.2 0.9,20 | 0.9,20 v1,20
  Bottom 0.2: v47.75,23.75 v47.75,29.08
  Bottom 0.5: v1,20 3.6,20 4.8,21.2 4.8,22.4 v6.1,23.7
PWM0  (via drill 0.4)
  Top 0.2: 18.53,31.66 18.53,31.86 18.67,32 48.31,32 48.31,31.99 49.18,31.12 v50.29,31.12 | v53.98,5.46 53.98,4.27 R9.2
  Top 0.5: CN1.P32 18.53,31.66
  Bottom 0.2: v50.29,31.12 50.29,21.61 47.3,18.62 47.3,17.7 46.1,16.5 46.1,10 48.63,7.47 48.67,7.47 | 48.51,7.62 48.67,7.47 | 48.67,7.47 50.04,6.1 53.34,6.1 v53.98,5.46
PWM1  (via drill 0.4)
  Top 0.2: 15.99,26.28 15.95,26.29 16.05,26.42 15.8,26.67 15.11,26.67 14.73,27.05 14.73,31.37 16,32.64 v49.35,32.64 | v47.8,14.9 47.6,15.1 45,15.1 44.6,14.7 44.6,14.25 R10.2
  Top 0.5: CN1.P33 15.99,26.28
  Bottom 0.2: v49.35,32.64 50.36,32.64 51.56,31.44 51.56,22.1 47.8,18.34 v47.8,14.9
REXT
  Top 0.2: IC1.7 30.12,17.57 R1.1
RIGHT
  Top 0.2: C7.2 42.69,5.99 43.3,6.6 48.6,6.6 48.7,6.5 48.7,6.4
  Top 0.5: C7.2 36.71,5.33 35.82,4.44 34.84,4.44 CN3.3 | C11.2 48.8,6.3 48.7,6.4
SCL  (via drill 0.4)
  Top 0.2: IC1.2 32.9,18.95 33.17,19.22 33.88,19.22 v34.02,19.07 | 50.8,21.98 50.81,21.84 32.74,21.84 32.52,22.06 v32.52,22.62 | v32.96,13.14 24.32,13.14 21.59,15.87 17.4,15.87 17.02,16.26 9.26,16.26 6.9,13.5 6.9,12.4 6.25,11.75 CN2.4
  Top 0.5: 50.8,21.98 51.55,22.73 CN1.P5
  Bottom 0.2: 32.89,13.08 v32.96,13.14 32.9,13.2 32.9,18.95 33.17,19.22 33.88,19.22 v34.02,19.07 34.02,20.25 33.8,20.47 32.8,20.47 32.52,20.75 v32.52,22.62
SDA  (via drill 0.4)
  Top 0.2: IC1.3 IC1.4 v32.1,19.45 | v50.6,17.66 50.21,17.27 40.51,17.27 37.21,13.97 32.52,13.97 v32.13,14.36 32.13,14.48 32,14.35 23.75,14.35 21.72,16.38 17.53,16.38 17.14,16.76 9.16,16.76 6.4,13.6 6.4,12.7 5.95,12.25 CN2.3
  Top 0.5: CN1.P3 54.1,23.72 | 54.2,23.72 v55.37,24.89
  Top 0.813: 54.1,23.72 54.2,23.72
  Bottom 0.2: v55.37,24.89 53.59,23.11 53.59,21.75 50.6,18.76 v50.6,17.66 | 32.13,14.48 32.14,14.49 v32.13,14.36 32.1,14.39 v32.1,19.45
VREG
  Top 0.2: C2.2 30.77,18.76 30.99,18.54 31.67,18.54 IC1.5

### Text on the board
Measures: 3 no. ⌀3.2mm holes | 7x12 + 7 no. ⌀1mm holes